# Altium schematic sheet PIC32.SchDoc
size A; SheetNumber: 13; SheetTotal: 13
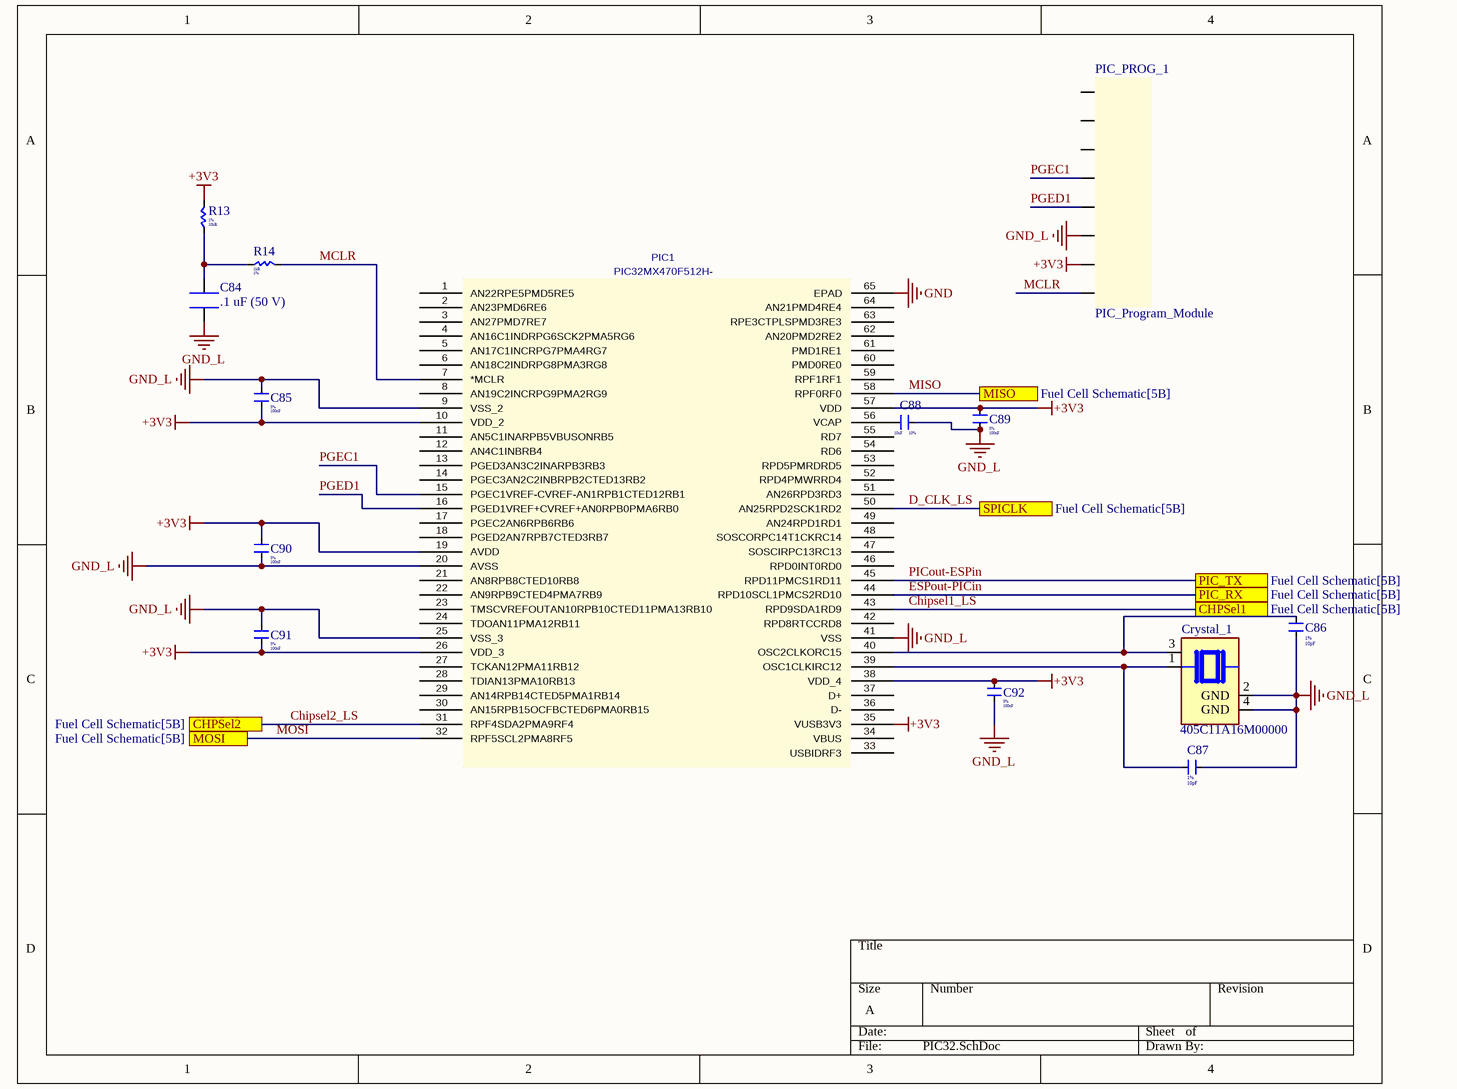
[diagram p0: PIC32.SchDoc]

## Parts
C84  .1 uF (50 V)  [.1uF capacitor]
C85  Dissipation Factor: 5%  Capacitance: 100nF  [Capacitor_Kemet_0805]
C86  Tollerance: 1%  Capacitance: 10pF  [Kemet_10pF_0805]
C87  Tollerance: 1%  Capacitance: 10pF  [Kemet_10pF_0805]
C88  Dissipation Factor: 10%  Capacitance: 10uF  [Capacitor_Kemet_0805]
C89  Dissipation Factor: 5%  Capacitance: 100nF  [Capacitor_Kemet_0805]
C90  Dissipation Factor: 5%  Capacitance: 100nF  [Capacitor_Kemet_0805]
C91  Dissipation Factor: 5%  Capacitance: 100nF  [Capacitor_Kemet_0805]
C92  Dissipation Factor: 5%  Capacitance: 100nF  [Capacitor_Kemet_0805]
Crystal_1  405C11A16M00000  [XTAL_405C11A16M00000]
PIC1  PIC32MX470F512H-  [Quad64_2]
PIC_PROG_1  PIC_Program_Module  [PIC_32_POD]
R13  Tolerance: 1%  Resistance: 10kR  [Resistor_YAGEO_0805]
R14  Resistance: 1kR  Tolerance: 1%  [Resistor_YAGEO_0805]

## Ports
CHPSel1 (see Fuel Cell Schematic[5B]), CHPSel2 (see Fuel Cell Schematic[5B]), MISO (see Fuel Cell Schematic[5B]), MOSI (see Fuel Cell Schematic[5B]), PIC_RX (see Fuel Cell Schematic[5B]), PIC_TX (see Fuel Cell Schematic[5B]), SPICLK (see Fuel Cell Schematic[5B])

## Nets
+3V3: C85.1 C89.2 C90.2 C91.1 C92.2 PIC1.10(VDD_2) PIC1.19(AVDD) PIC1.26(VDD_3) PIC1.35(VUSB3V3) PIC1.38(VDD_4) PIC1.57(VDD) PIC_PROG_1.2(VDD) R13.2
GND: PIC1.65(EPAD)
GND_L: C84.2 C85.2 C86.2 C87.1 C88.2 C89.1 C90.1 C91.2 C92.1 Crystal_1.2(GND) Crystal_1.4(GND) PIC1.9(VSS_2) PIC1.20(AVSS) PIC1.25(VSS_3) PIC1.41(VSS) PIC_PROG_1.3(GND)
Chipsel1_LS: PIC1.43(RPD9SDA1RD9) ; port CHPSel1
Chipsel2_LS: PIC1.31(RPF4SDA2PMA9RF4) ; port CHPSel2
D_CLK_LS: PIC1.50(AN25RPD2SCK1RD2) ; port SPICLK
ESPout-PICin: PIC1.44(RPD10SCL1PMCS2RD10) ; port PIC_RX
MCLR: PIC1.7(*MCLR) PIC_PROG_1.1(MCLR) R14.2
MISO: PIC1.58(RPF0RF0) ; port MISO
MOSI: PIC1.32(RPF5SCL2PMA8RF5) ; port MOSI
PGEC1: PIC1.15(PGEC1VREF-CVREF-AN1RPB1CTED12RB1) PIC_PROG_1.5(PGEC)
PGED1: PIC1.16(PGED1VREF+CVREF+AN0RPB0PMA6RB0) PIC_PROG_1.4(PGED)
PICout-ESPin: PIC1.45(RPD11PMCS1RD11) ; port PIC_TX
NetC84_1: C84.1 R13.1 R14.1
NetC86_1: C86.1 Crystal_1.3 PIC1.40(OSC2CLKORC15)
NetC87_2: C87.2 Crystal_1.1 PIC1.39(OSC1CLKIRC12)
NetC88_1: C88.1 PIC1.56(VCAP)

Not connected (* = marked no-connect by the designer): PIC1 1(AN22RPE5PMD5RE5) 2(AN23PMD6RE6) 3(AN27PMD7RE7) 4(AN16C1INDRPG6SCK2PMA5RG6) 5(AN17C1INCRPG7PMA4RG7) 6(AN18C2INDRPG8PMA3RG8) 8(AN19C2INCRPG9PMA2RG9) 11(AN5C1INARPB5VBUSONRB5) 12(AN4C1INBRB4) 13(PGED3AN3C2INARPB3RB3) 14(PGEC3AN2C2INBRPB2CTED13RB2) 17(PGEC2AN6RPB6RB6) 18(PGED2AN7RPB7CTED3RB7) 21(AN8RPB8CTED10RB8) 22(AN9RPB9CTED4PMA7RB9) 23(TMSCVREFOUTAN10RPB10CTED11PMA13RB10) 24(TDOAN11PMA12RB11) 27(TCKAN12PMA11RB12) 28(TDIAN13PMA10RB13) 29(AN14RPB14CTED5PMA1RB14) 30(AN15RPB15OCFBCTED6PMA0RB15) 33(USBIDRF3) 34(VBUS) 36(D-) 37(D+) 42(RPD8RTCCRD8) 46(RPD0INT0RD0) 47(SOSCIRPC13RC13) 48(SOSCORPC14T1CKRC14) 49(AN24RPD1RD1) 51(AN26RPD3RD3) 52(RPD4PMWRRD4) 53(RPD5PMRDRD5) 54(RD6) 55(RD7) 59(RPF1RF1) 60(PMD0RE0) 61(PMD1RE1) 62(AN20PMD2RE2) 63(RPE3CTPLSPMD3RE3) 64(AN21PMD4RE4); PIC_PROG_1 6 7 8

## Library data of the parts
C84 = .1 uF cap
C85 C89-C92 = C0805C104J4RACTU: Cap Ceramic 0.1uF 16V X7R 5% SMD 0805 125°C Plastic T/R; Manufacturer: KEMET; Supplier 1: Digi-Key; Manufacturer Part Number: C0805C104J4RACTU; RoHS: Yes; Category: Ceramic Capacitors; Stock 1: 21669; Pricing 1: 1=0.53000, 10=0.37300, 50=0.28180, 100=0.24540, 500=0.18180, 1000=0.15453 (USD); Mount: Surface Mount; Case/Package: 0805; Case Code (Imperial): 0805; Case Code (Metric): 2012; Dielectric Material: Ceramic; Min Operating Temperature: -55°C; Max Operating Temperature: 125°C; Package Quantity: 4000; Packaging: Tape and Reel; Voltage Rating: 16V; Voltage Rating (DC): 16V; Dielectric: X7R; Termination: SMD/SMT; Series: -; Length: 2mm; Width: 1.2mm; Height: 0.9mm; Lead Pitch: 0.75mm; Thickness: 0.035inch; Depth: 1.25mm; RoHS Compliant: Yes; ComponentLink1URL: http://www.farnell.com/datasheets/2746326.pdf?src-supplier=Farnell; ComponentLink1Description: http://www.farnell.com/datasheets/2746326.pdf?src-supplier=Farnell; ComponentLink2URL: http://www.farnell.com/datasheets/2323359.pdf?src-supplier=Farnell; ComponentLink2Description: http://www.farnell.com/datasheets/2323359.pdf?src-supplier=Farnell; ComponentLink3URL: http://www.mouser.com/ds/2/212/KEM_C1002_X7R_SMD-1102033.pdf?src-supplier=Mouser; ComponentLink3Description: http://www.mouser.com/ds/2/212/KEM_C1002_X7R_SMD-1102033.pdf?src-supplier=Mouser; ComponentLink4URL: http://components.arrow.com/part/dataview/3452184S4481915N7429?src-supplier=Arrow+Electronics; ComponentLink4Description: http://components.arrow.com/part/dataview/3452184S4481915N7429?src-supplier=Arrow+Electronics; ComponentLink5URL: https://api.kemet.com/component-edge/download/datasheet/C0805C104J4RACTU.pdf?src-supplier=Digi-Key; ComponentLink5Description: https://api.kemet.com/component-edge/download/datasheet/C0805C104J4RACTU.pdf?src-supplier=Digi-Key; ComponentLink6URL: http://www.farnell.com/datasheets/2330568.pdf?src-supplier=Newark; ComponentLink6Description: http://www.farnell.com/datasheets/2330568.pdf?src-supplier=Newark; ComponentLink7URL: http://www.farnell.com/datasheets/2746326.pdf?src-supplier=Newark; ComponentLink7Description: http://www.farnell.com/datasheets/2746326.pdf?src-supplier=Newark; Supplier Part Number 1: 399-C0805C104J4RAC7800CT-ND
C86 C87 = C0805C100F5GACAUTO: Cap, AEC-Q200, 10PF, 50V, Mlcc, 0805;; Manufacturer: KEMET; Supplier 1: Digi-Key; RoHS: Yes; Category: Ceramic Capacitors; Stock 1: 3879; Pricing 1: 1=0.74000, 10=0.54800, 50=0.43840, 100=0.37570, 500=0.29744, 1000=0.25048 (USD); RoHS Compliant: Yes; Supplier Part Number 1: 399-C0805C100F5GACAUTOCT-ND; Manufacturer Part Number: C0805C100F5GACAUTO
C88 = C0805C106K3PACTU: 0805 C 10uF Ceramic Multilayer Capacitor; 25 VDC; +85degC; X5R Dielec; +/-10%; Manufacturer: KEMET; Voltage Rating: 25V; Supplier 1: Digi-Key; Manufacturer Part Number: C0805C106K3PACTU; RoHS: Yes; Category: Ceramic Capacitors; Stock 1: 269800; Pricing 1: 1=0.27000, 10=0.18400, 50=0.11040, 100=0.09330, 500=0.06382, 1000=0.05645 (USD); Mount: Surface Mount; Case/Package: 0805; Case Code (Metric): 2012; Case Code (Imperial): 0805; Dielectric Material: Ceramic; Min Operating Temperature: -55°C; Max Operating Temperature: 85°C; Dielectric: X5R; Packaging: Cut Tape; Voltage: 25V; Termination: Solder; Tolerance: 10%; Voltage Rating (DC): 25V; Length: 0.079inch; Width: 0.049inch; Height: 1.25mm; Depth: 1.25mm; Thickness: 0.057inch; REACH SVHC: No SVHC; Lead Free: Lead Free; RoHS Compliant: Yes; ComponentLink1URL: http://www.farnell.com/datasheets/2741185.pdf?src-supplier=Farnell; ComponentLink1Description: http://www.farnell.com/datasheets/2741185.pdf?src-supplier=Farnell; ComponentLink2URL: http://www.alliedelec.com/m/d/f3c02ddb98afa3dd1adcb801109671e9.pdf?src-supplier=Allied+Electronics; ComponentLink2Description: http://www.alliedelec.com/m/d/f3c02ddb98afa3dd1adcb801109671e9.pdf?src-supplier=Allied+Electronics; ComponentLink3URL: https://api.kemet.com/component-edge/download/datasheet/C0805C106K3PAC7800.pdf?src-supplier=Digi-Key; ComponentLink3Description: https://api.kemet.com/component-edge/download/datasheet/C0805C106K3PAC7800.pdf?src-supplier=Digi-Key; ComponentLink4URL: http://www.kemet.com/docfinder?Partnumber=C0805C106K3PAC7800&src-supplier=Digi-Key; ComponentLink4Description: http://www.kemet.com/docfinder?Partnumber=C0805C106K3PAC7800&src-supplier=Digi-Key; ComponentLink5URL: http://www.kemet.com/Lists/ProductCatalog/Attachments/19/KEM_C1006_X5R_SMD.pdf?src-supplier=Avnet; ComponentLink5Description: http://www.kemet.com/Lists/ProductCatalog/Attachments/19/KEM_C1006_X5R_SMD.pdf?src-supplier=Avnet; ComponentLink6URL: http://www.farnell.com/datasheets/2741185.pdf?src-supplier=Newark; ComponentLink6Description: http://www.farnell.com/datasheets/2741185.pdf?src-supplier=Newark; ComponentLink7URL: http://www.farnell.com/datasheets/2741185.pdf?src-supplier=Element14; ComponentLink7Description: http://www.farnell.com/datasheets/2741185.pdf?src-supplier=Element14; Supplier Part Number 1: 399-11939-1-ND
Crystal_1 = 405C11A16M00000: CRYSTAL 16.0000MHZ 10PF SMD; MF: CTS-Frequency Controls; Digi-Key_Part_Number: CTX834TR-ND; Check_prices: https://www.snapeda.com/parts/405C11A16M00000/CTS-Frequency+Controls/view-part/?ref=eda; Purchase-URL: https://pricing.snapeda.com/search/part/405C11A16M00000/?ref=eda; Package: NON STANDARD-4 CTS Components; MP: 405C11A16M00000; Value: *; SnapEDA_Link: https://www.snapeda.com/parts/405C11A16M00000/CTS-Frequency+Controls/view-part/?ref=snap
PIC1 = PIC32MX470F512H-: Mfr_Name: Microchip; Manufacturer_Part_Number: PIC32MX470F512H-I/MR; C: Copyright (C) 2018 Accelerated Designs. All rights reserved; Value: PIC32MX470F512H-; Copyright: Copyright (C) 2023 Ultra Librarian. All rights reserved.
R13 = RC0805FR-1010KL: RES 10K OHM 1% 1/8W 0805; Manufacturer: Yageo; Power Rating: 125mW; Voltage Rating: 150V; Temperature Coefficient: 100ppm/°C; Supplier 1: Digi-Key; Manufacturer Part Number: RC0805FR-1010KL; RoHS: Yes; Category: Chip SMD Resistors; Stock 1: 112355; Pricing 1: 1=0.10000, 10=0.03700, 100=0.01510, 1000=0.00680, 2500=0.00590, 5000=0.00487 (USD); Case/Package: 0805; Number of Pins: 2; Case Code (Imperial): 0805; Case Code (Metric): 2012; Contact Plating: Tin,Lead,Matte; Min Operating Temperature: -55°C; Max Operating Temperature: 155°C; Packaging: Tape and Reel; Resistor Type: Thick Film; Termination: SMD/SMT; Voltage Rating (DC): 150V; Series: RC; Resistance Tolerance: 1%; Construction: Rectangular; Length: 2mm; Width: 1.25mm; Height: 0.5mm; Depth: 1.25mm; Radiation Hardening: No; REACH SVHC: No SVHC; Military Standard: Not; RoHS Compliant: Yes; ComponentLink1URL: https://datasheet.ciiva.com/7983/444164-7983754.pdf?src-supplier=Element14; ComponentLink1Description: https://datasheet.ciiva.com/7983/444164-7983754.pdf?src-supplier=Element14; ComponentLink2URL: https://datasheet.ciiva.com/15190/getdatasheetpartid-496654-15190027.pdf?src-supplier=Verical; ComponentLink2Description: https://datasheet.ciiva.com/15190/getdatasheetpartid-496654-15190027.pdf?src-supplier=Verical; Supplier Part Number 1: 13-RC0805FR-1010KLCT-ND
R14 = RC0805FR-071KP: Res Thick Film 0805 1K Ohm 1% 0.125W(1/8W) ±100ppm/C Pad SMD T/R; Manufacturer: Yageo; Max Power Dissipation: 125mW; Temperature Coefficient: 100ppm/°C; Supplier 1: Digi-Key; Manufacturer Part Number: RC0805FR-071KP; RoHS: Yes; Category: Chip SMD Resistors; Stock 1: 37560; Pricing 1: 1=0.10000, 10=0.06400, 100=0.02600, 1000=0.01168, 2500=0.01014 (USD); Case/Package: 0805; Case Code (Metric): 2012; Case Code (Imperial): 0805; Min Operating Temperature: -55°C; Max Operating Temperature: 155°C; Packaging: Tape and Reel; Resistor Type: Thick Film; Number of Terminations: 2; Features: Moisture Resistant; Length: 0.079inch; Width: 0.049inch; Height: 0.024inch; RoHS Compliant: Yes; ComponentLink1URL: http://www.yageo.com/NewPortal/yageodocoutput?fileName=/pdf/R-Chip/PYu-RC_51_RoHS_P_0.pdf&src-supplier=Digi-Key; ComponentLink1Description: http://www.yageo.com/NewPortal/yageodocoutput?fileName=/pdf/R-Chip/PYu-RC_51_RoHS_P_0.pdf&src-supplier=Digi-Key; ComponentLink2URL: http://www.yageo.com.tw/exep/pages/download/literatures/PYu-R_INT-thick_7.pdf?src-supplier=Digi-Key; ComponentLink2Description: http://www.yageo.com.tw/exep/pages/download/literatures/PYu-R_INT-thick_7.pdf?src-supplier=Digi-Key; Supplier Part Number 1: YAG1321CT-ND